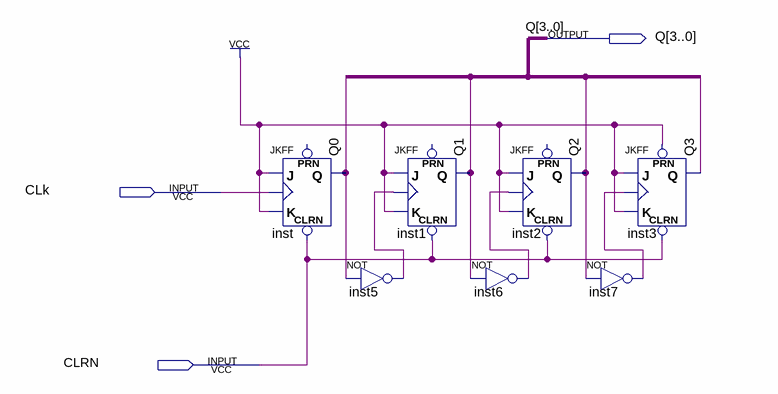
[diagram p0: schematic sheet]
// Quartus schematic lab10step3a.bdf as structural Verilog: 7 symbols, 3 pins
module lab10step3a (
  input  CLk,
  input  CLRN,
  output [3:0] Q
);

  wire inst5_out, inst6_out, inst7_out;

  JKFF inst (.CLRN(CLRN), .K(1'b1), .J(1'b1), .CLK(CLk), .Q(Q[0]));  // open: PRN
  not inst5 (inst5_out, Q[0]);
  JKFF inst1 (.CLRN(CLRN), .K(1'b1), .J(1'b1), .CLK(inst5_out), .Q(Q[1]));  // open: PRN
  not inst6 (inst6_out, Q[1]);
  JKFF inst2 (.CLRN(CLRN), .K(1'b1), .J(1'b1), .CLK(inst6_out), .Q(Q[2]));  // open: PRN
  JKFF inst3 (.PRN(1'b1), .CLRN(CLRN), .K(1'b1), .J(1'b1), .CLK(inst7_out), .Q(Q[3]));
  not inst7 (inst7_out, Q[2]);
endmodule
